# Altium schematic sheet eVPS_Cover Page.SchDoc: eVPS_Cover Page
size A4; DrawnBy: Ivica Matovic; Revision: v1.1; SheetNumber: 1; SheetTotal: 3
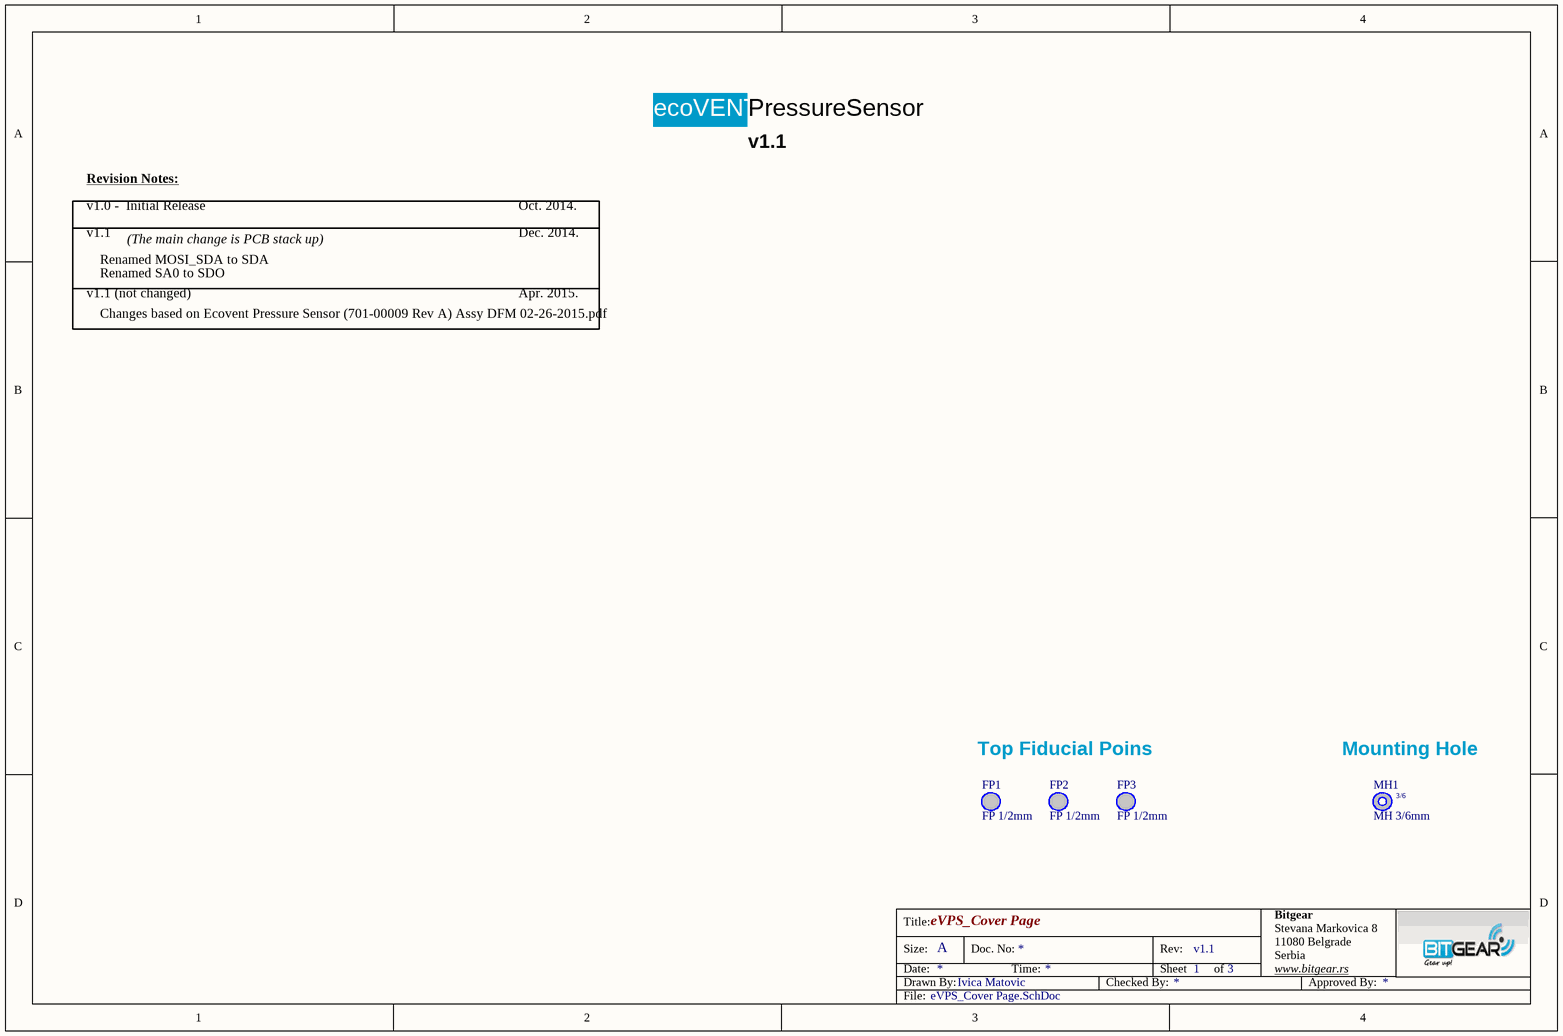
[diagram p0: eVPS_Cover Page.SchDoc]

## Parts
FP1  FP 1/2mm  [FIDUCIAL_POINT_1MM]  (no BOM)
FP2  FP 1/2mm  [FIDUCIAL_POINT_1MM]  (no BOM)
FP3  FP 1/2mm  [FIDUCIAL_POINT_1MM]  (no BOM)
MH1  MH 3/6mm  [MHOLE_TH_3-6MM]  (no BOM)

## Notes on the sheet
- ecoVENT
- PressureSensor
- v1.1
- Revision Notes:
- v1.0 -  Initial Release
- (The main change is PCB stack up)
- Oct. 2014.
- Dec. 2014.
- v1.1 (not changed)
- Renamed MOSI_SDA to SDA
- Renamed SA0 to SDO
- Apr. 2015.
- Changes based on Ecovent Pressure Sensor (701-00009 Rev A) Assy DFM 02-26-2015.pdf
- Top Fiducial Poins
- (near MH1) Mounting Hole
- Title:
- Bitgear
- Size:
- Date:
- Drawn By:
- A
- Doc. No:
- Time:
- Checked By:
- Sheet
- Rev:
- of
- Stevana Markovica 8
- 11080 Belgrade
- Serbia
- www.bitgear.rs
- Approved By:
- File:
- (in symbol MH 3/6mm) 3/6

## Library data of the parts
FP1-FP3 = FP 1/2mm: Fiducial point; D Price: 0; D P/N: FIDUCIALP; M P/N: FIDUCIALP; Mounting: SM
MH1 = MH 3/6mm: Mounting Hole Not-plated; D P/N: MHOLE; D Price: 0; M P/N: MHOLE; Mounting: SM